# Altium schematic sheet main.SchDoc
size A3
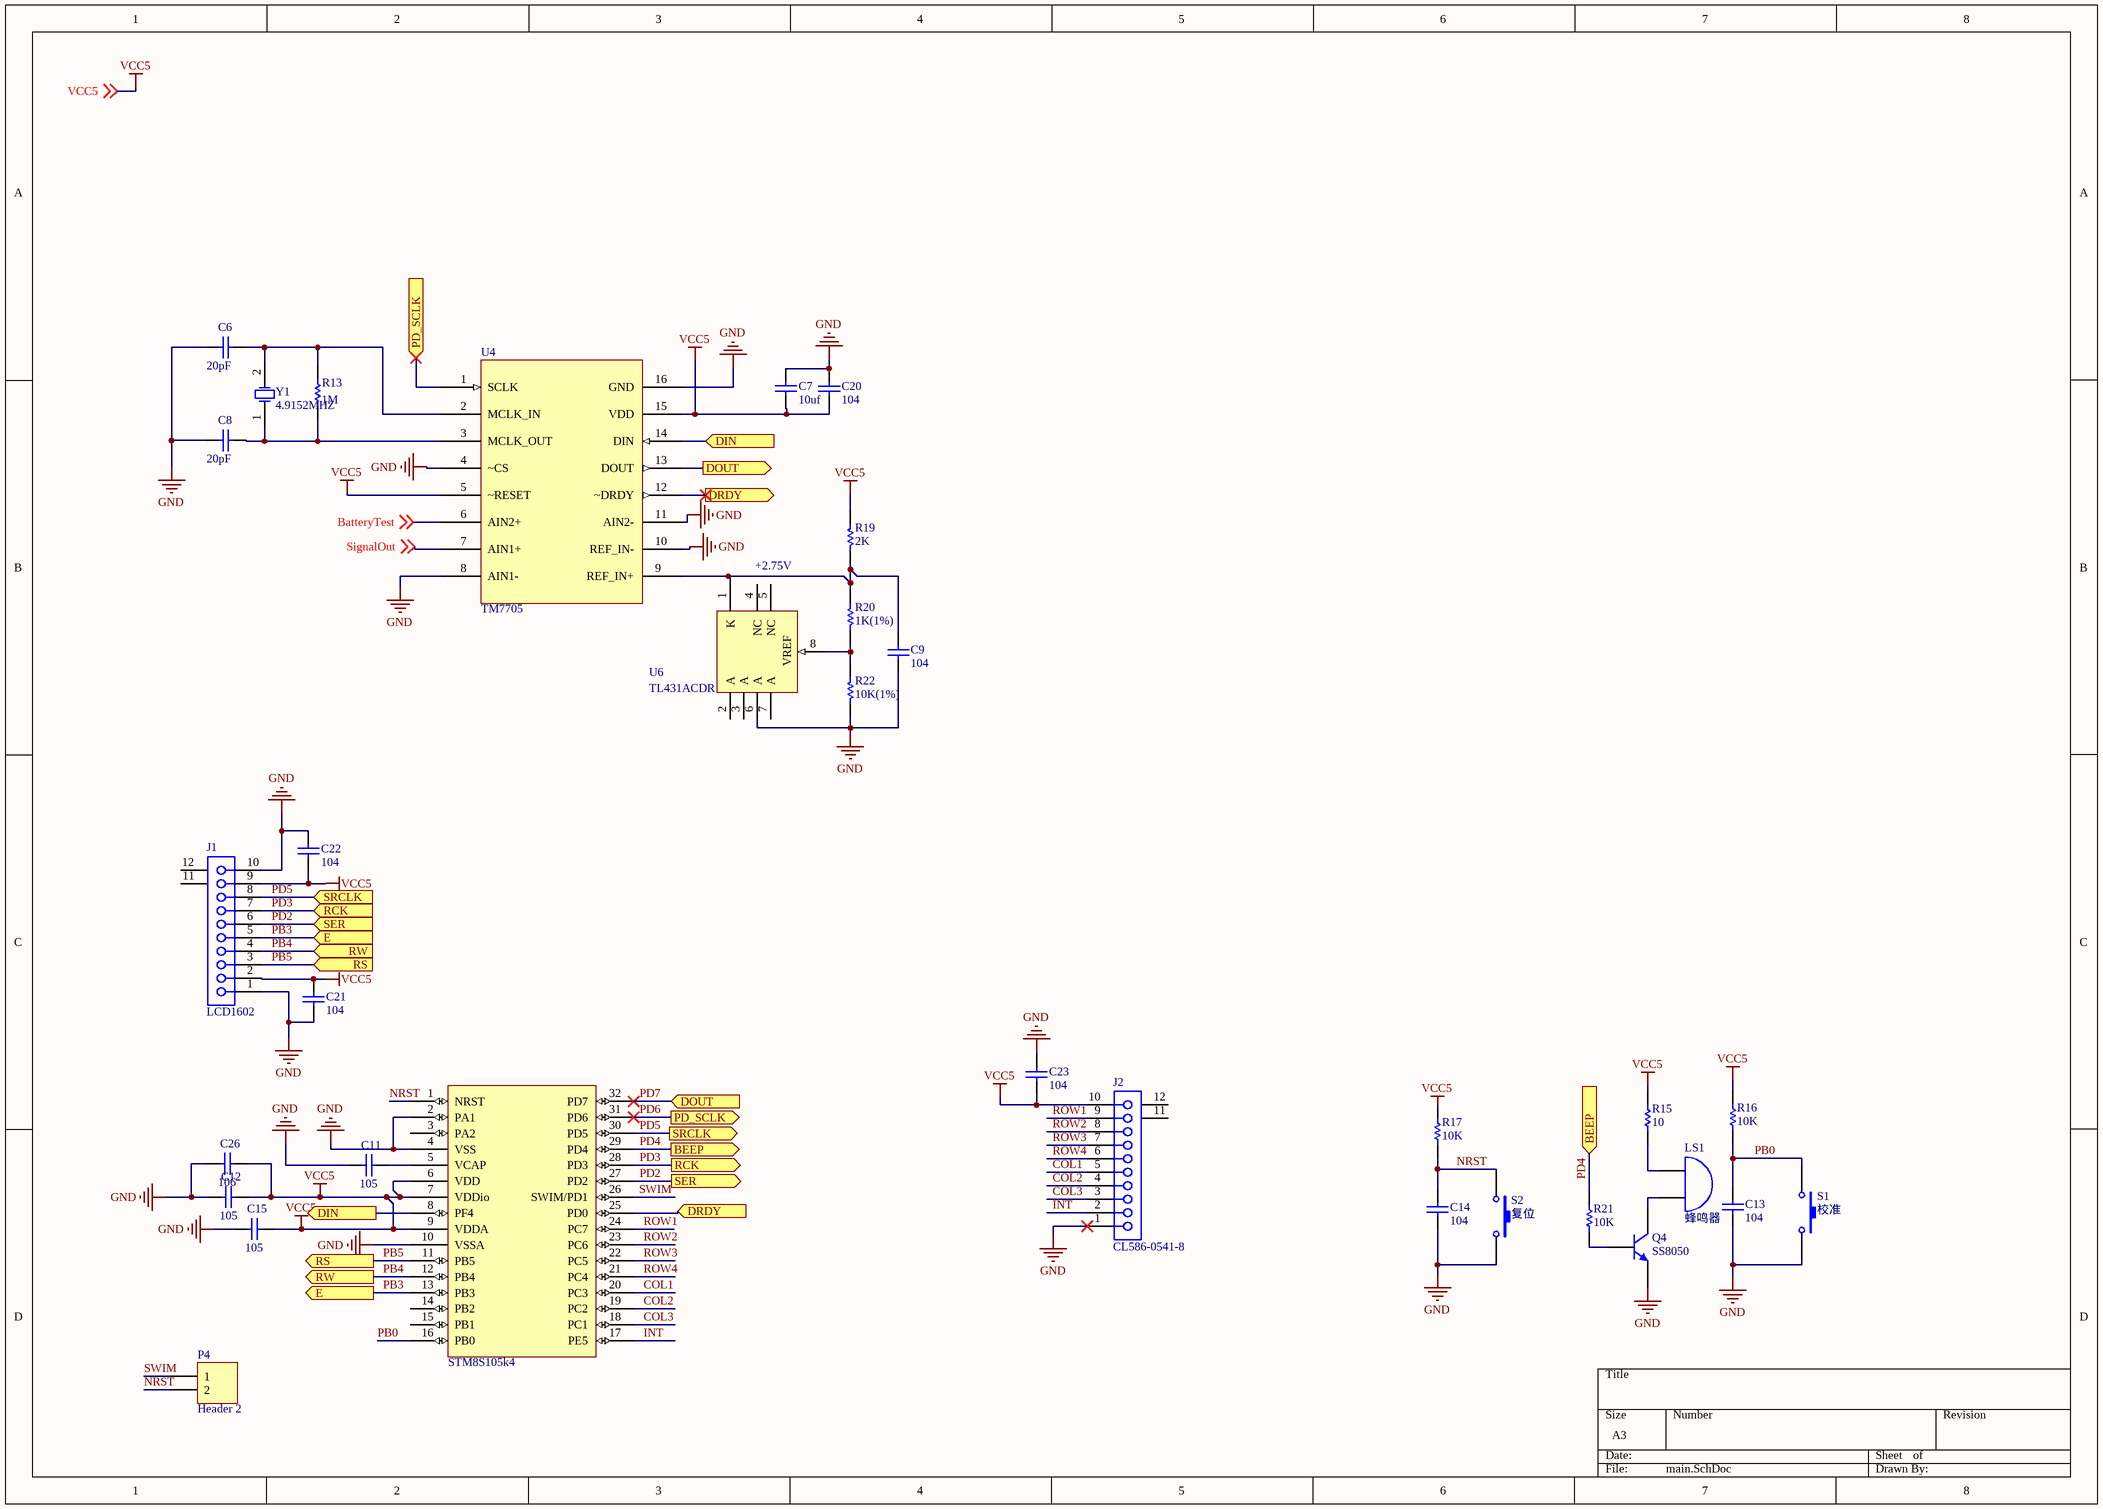
[diagram p0: main.SchDoc]

## Parts
C6  value 20pF  [C0805]  (hidden comment: Cap)
C7  value 10uf  [C0805]  (hidden comment: Cap)
C8  value 20pF  [C0805]  (hidden comment: Cap)
C9  value 104  [C0805]  (hidden comment: Cap)
C11  value 105  [C0805]  (hidden comment: Cap)
C12  value 105  [C0805]  (hidden comment: Cap)
C13  value 104  [C0805]  (hidden comment: Cap)
C14  value 104  [C0805]  (hidden comment: Cap)
C15  value 105  [C0805]  (hidden comment: Cap)
C20  value 104  [C0805]  (hidden comment: Cap)
C21  value 104  [C0805]  (hidden comment: Cap)
C22  value 104  [C0805]  (hidden comment: Cap)
C23  value 104  [C0805]  (hidden comment: Cap)
C26  value 106  [C0805]  (hidden comment: Cap)
J1  LCD1602  [FH12-22(10)SA-1SH]
J2  CL586-0541-8  [FH12-22(10)SA-1SH]
LS1  蜂鸣器  [BELL]
P4  Header 2  [HDR1X2]
Q4  SS8050  [SOT-23_N]
R13  value 1M  [C1206]  (hidden comment: Res1)
R15  value 10  [C1206]  (hidden comment: Res1)
R16  value 10K  [6-0805_N]  (hidden comment: Res1)
R17  value 10K  [6-0805_N]  (hidden comment: Res1)
R19  value 2K  [6-0805_N]  (hidden comment: Res1)
R20  value 1K(1%)  [6-0805_N]  (hidden comment: Res1)
R21  value 10K  [6-0805_N]  (hidden comment: Res1)
R22  value 10K(1%)  [6-0805_N]  (hidden comment: Res1)
S1  校准  [buttin12*12]
S2  复位  [buttin6*6]
STM1  STM8S105k4  [LQFP32]
U4  TM7705  [SO16_N]
U6  TL431ACDR  [D008_N]
Y1  4.9152MHZ  [XTAL-HC49US2]

## Ports
BEEP (in), BEEP (out), DIN (in), DIN (out), DOUT (in), DOUT (out), DRDY (in), DRDY (out), E (in), E (out), PD_SCLK (in), PD_SCLK (out), RCK (in), RCK (out), RS (in), RS (out), RW (in), RW (out), SER (in), SER (out), SRCLK (in), SRCLK (out)

## Nets
GND: C6.1 C7.2 C8.1 C9.1 C11.1 C12.1 C13.1 C14.1 C15.1 C20.2 C21.2 C22.1 C23.2 C26.1 J1.1 J1.10 J2.1 Q4.3(E) R22.2 S1.2 S2.2 STM1.2(PA1) STM1.4(VSS) STM1.10(VSSA) U4.4(~CS) U4.8(AIN1-) U4.10(REF_IN-) U4.11(AIN2-) U4.16(GND) U6.6(A)
VCC5: C7.1 C12.2 C15.2 C20.1 C21.1 C22.2 C23.1 C26.2 J1.2 J1.9 J2.10 R15.1 R16.1 R17.1 R19.1 STM1.6(VDD) STM1.7(VDDio) STM1.9(VDDA) U4.5(~RESET) U4.15(VDD) ; off-sheet VCC5
BatteryTest: U4.6(AIN2+) ; off-sheet BatteryTest
COL1: J2.5 STM1.20(PC3)
COL2: J2.4 STM1.19(PC2)
COL3: J2.3 STM1.18(PC1)
DIN: STM1.8(PF4) U4.14(DIN) ; port DIN
DRDY: STM1.25(PD0) U4.12(~DRDY) ; port DRDY
INT: J2.2 STM1.17(PE5)
NRST: C14.2 P4.2 R17.2 S2.1 STM1.1(NRST)
PB0: C13.2 R16.2 S1.1 STM1.16(PB0)
PB3: J1.5 STM1.13(PB3) ; port E
PB4: J1.4 STM1.12(PB4) ; port RW
PB5: J1.3 STM1.11(PB5) ; port RS
PD2: J1.6 STM1.27(PD2) ; port SER
PD3: J1.7 STM1.28(PD3) ; port RCK
PD4: R21.2 STM1.29(PD4) ; port BEEP
PD5: J1.8 STM1.30(PD5) ; port SRCLK
PD6: STM1.31(PD6) U4.1(SCLK) ; port PD_SCLK
PD7: STM1.32(PD7) U4.13(DOUT) ; port DOUT
ROW1: J2.9 STM1.24(PC7)
ROW2: J2.8 STM1.23(PC6)
ROW3: J2.7 STM1.22(PC5)
ROW4: J2.6 STM1.21(PC4)
SignalOut: U4.7(AIN1+) ; off-sheet SignalOut
SWIM: P4.1 STM1.26(SWIM/PD1)
NetC6_2: C6.2 R13.1 U4.2(MCLK_IN) Y1.2(OSC2)
NetC8_2: C8.2 R13.2 U4.3(MCLK_OUT) Y1.1(OSC1)
NetC9_2: C9.2 R19.2 R20.1 U4.9(REF_IN+) U6.1(K)
NetC11_2: C11.2 STM1.5(VCAP)
NetLS1_1: LS1.1(A) R15.2
NetLS1_2: LS1.2(B) Q4.1(C)
NetQ4_2: Q4.2(B) R21.1
NetR20_2: R20.2 R22.1 U6.8(VREF)

Not connected (* = marked no-connect by the designer): J1 11(MH1) 12(MH2); J2 11(MH1) 12(MH2); STM1 3(PA2) 14(PB2) 15(PB1); U6 2(A) 3(A) 4(NC) 5(NC) 7(A)

## Notes on the sheet
- +2.75V

## Library data of the parts
C6-C9 C11-C15 C20-C23 C26 = Cap: Capacitor; Published: 8-Jun-2000; LatestRevisionDate: 17-Jul-2002; LatestRevisionNote: Re-released for DXP Platform.; PackageReference: RAD-0.3; Publisher: Altium Limited; PackageDescription: Radial Cap, Thru-Hole; 2 Leads; 0.3 in Pin Spacing
J1 J2 = CL586-0541-8: FH12 Series, "Flip-Lock" SMT/ZIF FFC/FPC Connector - 1.0mm Spaced Bottom Eccentric Contact; Positions: 10; ContactMaterial: Phosphor Bronze; Current: 0.5A; PCB_Layout: Complies with manufacturer's recommendation.; Note: Pad dimensions follow nominal values, Suitable for Wave Soldering, Adjust for Re-flow.; Published: 17-Jul-2002; DatasheetVersion: 13-Nov-2000; PackageVersion: 13-Nov-2000; PackageReference: FH12-22(10)SA-1SH; Publisher: Altium Limited; ComponentLink1Description: Manufacturer Link; ComponentLink1URL: http://www.hiroseusa.com/; ComponentLink2Description: Datasheet; ComponentLink2URL: http://www.hirose.co.jp/cataloge_hp/e58605370.pdf
LS1 = Bell: Electrical Bell; Published: 24-Mar-1999; LatestRevisionDate: 17-Jul-2002; LatestRevisionNote: Re-released for DXP Platform.; PackageReference: PIN2; Publisher: Altium Limited
P4 = Header 2: Header, 2-Pin; LatestRevisionDate: 17-Jul-2002; LatestRevisionNote: Re-released for DXP Platform.; Publisher: Altium Limited
Q4 = NPN: NPN Bipolar Transistor; pin to pad: 1>3 2>1 3>2; Published: 8-Jun-2000; LatestRevisionDate: 17-Jul-2002; LatestRevisionNote: Re-released for DXP Platform.; PackageReference: TO-226-AA; Publisher: Altium Limited; PackageDescription: TO, Flat Index; 3 In-Line, Axial Leads; Body Dia. 4.8mm; Leads 0.55 x 0.51 mm (max); Code_JEDEC: TO-226-AA
R13 R15-R17 R19-R22 = Res1: Resistor; Published: 8-Jun-2000; LatestRevisionDate: 17-Jul-2002; LatestRevisionNote: Re-released for DXP Platform.; PackageReference: AXIAL-0.3; Publisher: Altium Limited; PackageDescription: Axial Device, Thru-Hole; 2 Leads; 0.3 in Pin Spacing
S1 S2 = SW-PB: Switch; Published: 24-Mar-1999; LatestRevisionDate: 17-Jul-2002; LatestRevisionNote: Re-released for DXP Platform.; PackageReference: SPST-2; Publisher: Altium Limited; PackageDescription: Switch; 2 Leads
U6 = TL431ACDR: Adjustable Precision Shunt Regulator; Published: 15-Apr-2002; LatestRevisionDate: 13-Apr-2006; LatestRevisionNote: IPC-7351 Footprint Added.; DatasheetVersion: Oct-2000; PackageVersion: Jan-1998; PackageReference: D008; Publisher: Altium Limited; PackageDescription: 8-Pin Small Outline Integrated Circuit 1.27 mm Pitch; Code_IPC: SOIC127P600-8; ComponentLink1Description: Manufacturer Link; ComponentLink1URL: http://www.ti.com/; ComponentLink2Description: Datasheet; ComponentLink2URL: http://www-s.ti.com/sc/ds/tl431a.pdf
Y1 = XTAL: Crystal Oscillator; Published: 8-Jun-2000; LatestRevisionDate: 17-Jul-2002; LatestRevisionNote: Re-released for DXP Platform.; PackageReference: R38; Publisher: Altium Limited; PackageDescription: Crystal, Thru-Hole; 2 Leads; Body 3.1 x 8.2 mm (Dia.xH)